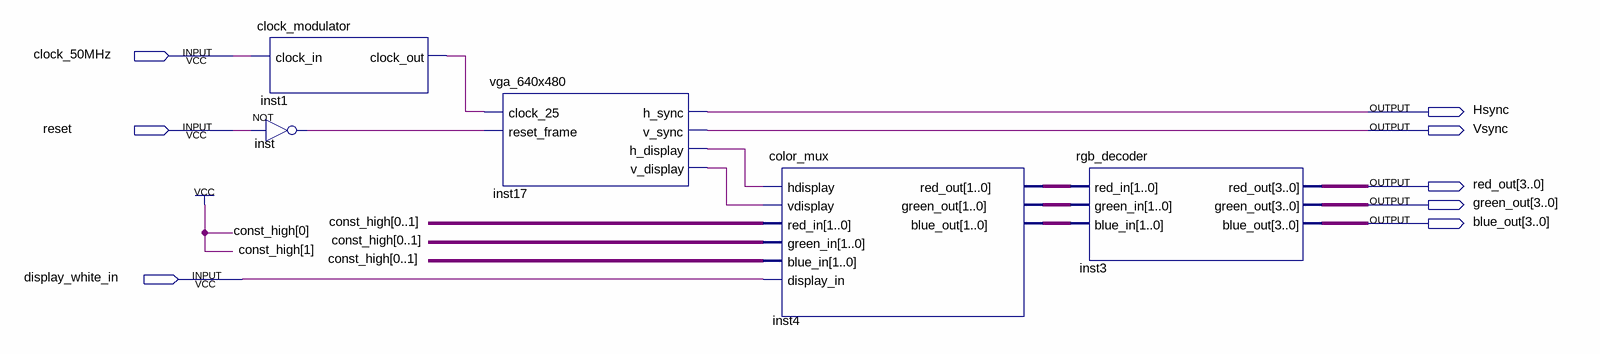
[diagram p0: schematic sheet]
// Quartus schematic vga_encoder.bdf as structural Verilog: 5 symbols, 8 pins
module vga_encoder (
  input  clock_50MHz,
  input  reset,
  input  display_white_in,
  output Hsync,
  output Vsync,
  output [3:0] red_out,
  output [3:0] green_out,
  output [3:0] blue_out
);

  wire inst1_clock_out, inst17_h_display, inst17_v_display, inst_out;
  wire [1:0] inst4_blue_out, inst4_green_out, inst4_red_out;

  clock_modulator inst1 (.clock_in(clock_50MHz), .clock_out(inst1_clock_out));
  not inst (inst_out, reset);
  vga_640x480 inst17 (
    .clock_25(inst1_clock_out), .reset_frame(inst_out), .h_sync(Hsync), .v_sync(Vsync),
    .h_display(inst17_h_display), .v_display(inst17_v_display));
  color_mux inst4 (
    .hdisplay(inst17_h_display), .vdisplay(inst17_v_display), .red_in(2'b11), .green_in(2'b11),
    .blue_in(2'b11), .display_in(display_white_in), .red_out(inst4_red_out), .green_out(inst4_green_out),
    .blue_out(inst4_blue_out));
  rgb_decoder inst3 (
    .red_in(inst4_red_out), .green_in(inst4_green_out), .blue_in(inst4_blue_out), .red_out(red_out),
    .green_out(green_out), .blue_out(blue_out));
endmodule
